# EasyEDA Pro project X轴限位转接板--(0909).eprj

# Schematic 原理图
Board Name: XZ转接板; Create Date: 2024-04-22; Page Name: 主控MCU; Project Name: Z轴转接板-0814; Schematic Name: 原理图; Update Date: 2025-05-19; Company: 嘉立创EDA; Page Size: A3; Version: V1.0
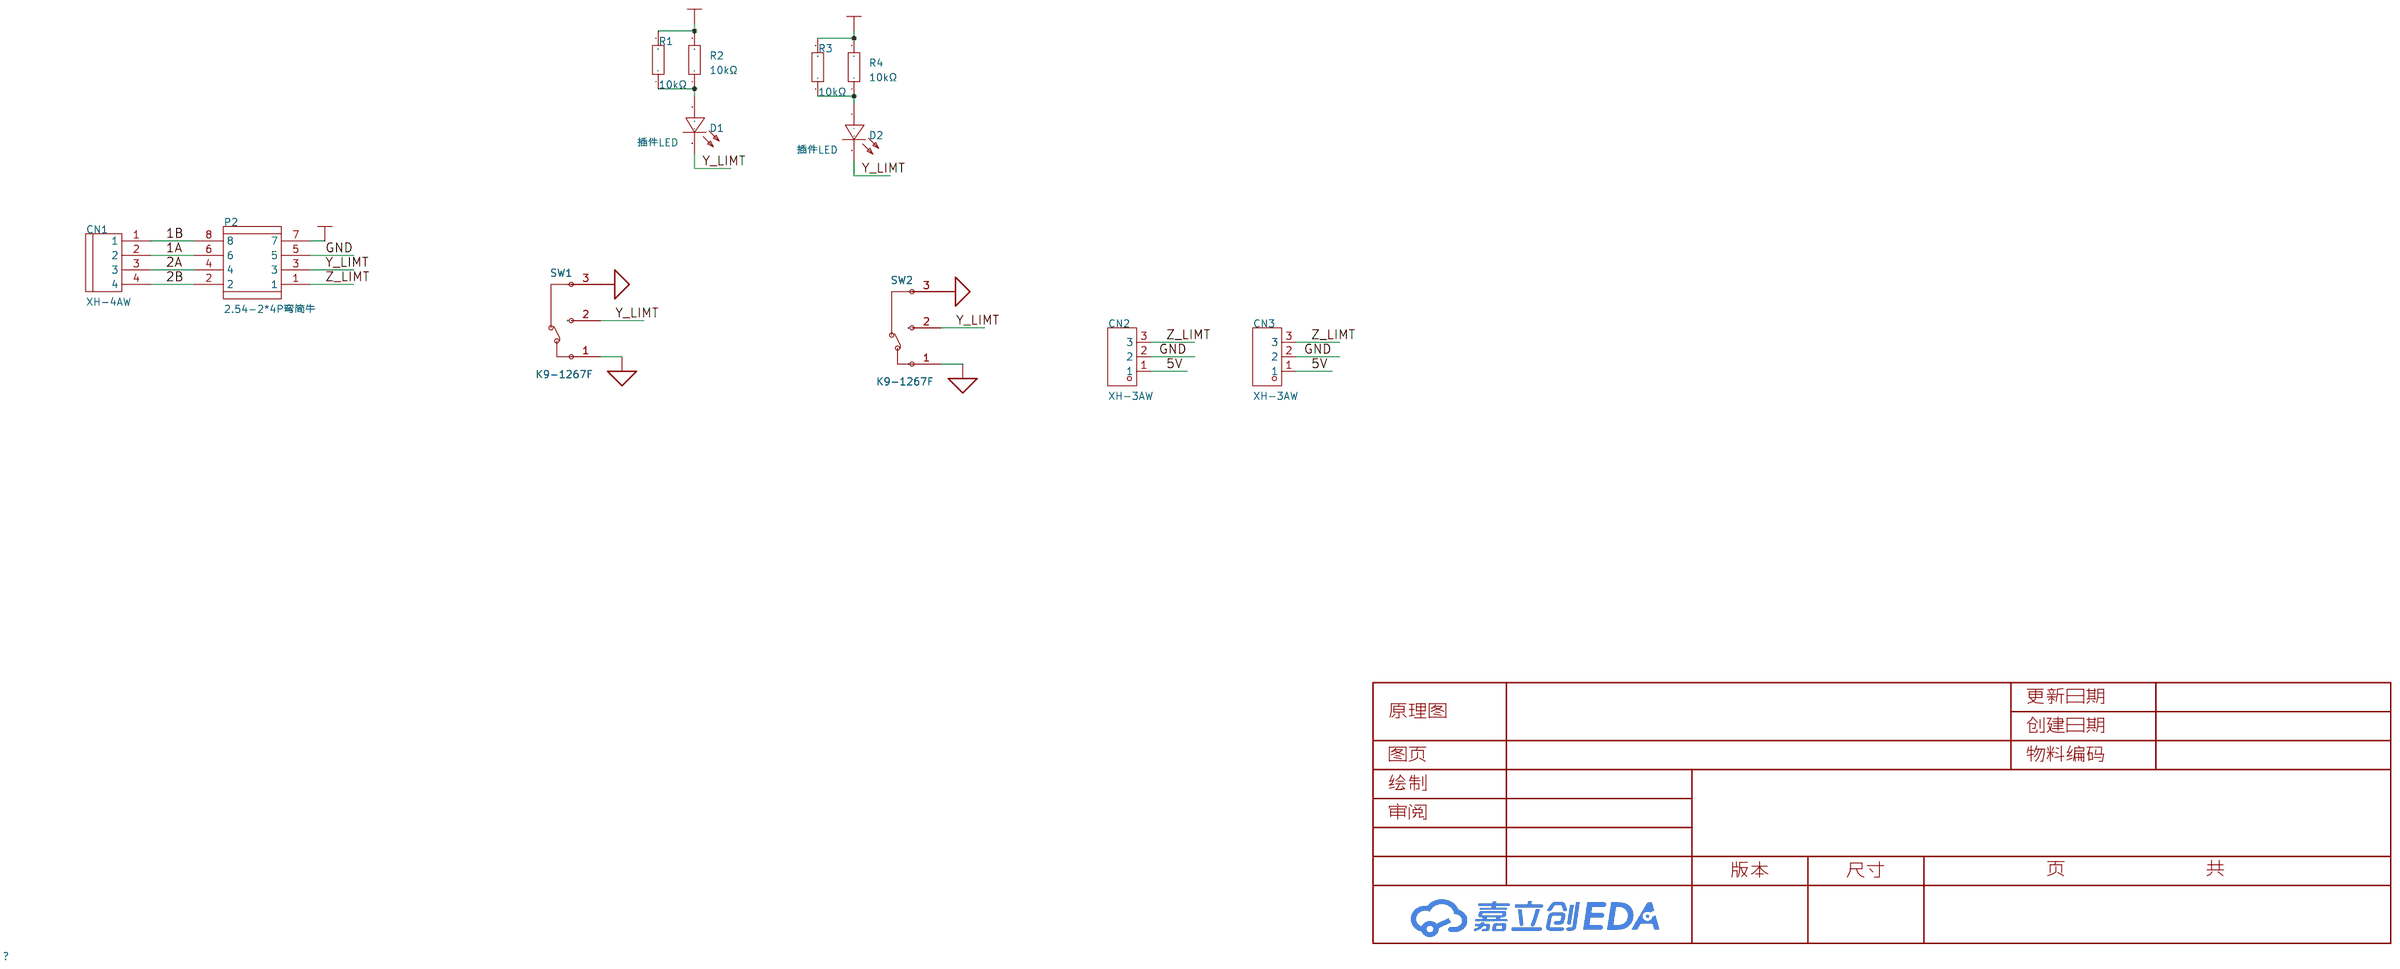
[diagram p0: schematic sheet]

## Parts
CN1  XH-4AW  [CONN-TH_XH2.54-4AW]
CN2  XH-3AW  [CONN-TH_3P-P2.50_XH-3A]
CN3  XH-3AW  [CONN-TH_3P-P2.50_XH-3A]
D1  插件LED  [LED-TH_BD3.8-P2.54-FD]
D2  插件LED  [LED-TH_BD3.8-P2.54-FD]
P2  2.54-2*4P弯简牛  [IDC-TH_8P-P2.54-H-R2-C4-S2.54]
R1  10kΩ  [R1206]
R2  10kΩ  [R1206]
R3  10kΩ  [R1206]
R4  10kΩ  [R1206]
SW1  K9-1267F  [SW-TH_K9-1267F]
SW2  K9-1267F  [SW-TH_K9-1267F]

## Library data of the parts
CN1 = XH-4AW: LCSC Part Name: XH-4AW，4P，脚距2.5mm，卧插; Supplier Part: C21273; Manufacturer: BOOMELE(博穆精密); Supplier Footprint: 插件,P=2.5mm; JLCPCB Part Class: Extended Part; Datasheet: https://atta.szlcsc.com/upload/public/pdf/source/20170919/C21273_1505787293543977054.pdf; Supplier: LCSC; Reference Series: XH; Pitch: 2.5mm; Pins Structure: 1x4P; Number of Rows: 1; Number of PINs Per Row: 4; Contact Material: 磷青铜
CN2 CN3 = XH-3AW: LCSC Part Name: XH-3AW，3P，脚距2.5mm，卧插 卧插; Supplier Part: C18428; Manufacturer: BOOMELE(博穆精密); Supplier Footprint: 插件,P=2.5mm; JLCPCB Part Class: Extended Part; Datasheet: https://atta.szlcsc.com/upload/public/pdf/source/20151222/1457707638029.pdf; Supplier: LCSC; Reference Series: XH; Pitch: 2.5mm; Pins Structure: 1x3P; Number of Rows: 1; Number of PINs Per Row: 3
D1 D2 = 204-10SURC/S530-A3-L: LCSC Part Name: 红灯; Supplier Part: C264302; Manufacturer: EVERLIGHT(台湾亿光); Supplier Footprint: 插件,D=3mm; JLCPCB Part Class: Extended Part; Datasheet: https://atta.szlcsc.com/upload/public/pdf/source/20181204/C264302_3C164FC09690301AE5D79DE2C4875559.pdf; Supplier: LCSC; Emitted Color: 红灯
P2 = 2.54-2*4P弯简牛: LCSC Part Name: 2.54mm 2x4P 排数:2 每排P数:4; Supplier Part: C9139; Manufacturer: BOOMELE(博穆精密); Supplier Footprint: 弯插,P=2.54mm; JLCPCB Part Class: 扩展库; Datasheet: https://atta.szlcsc.com/upload/public/pdf/source/20180802/C9139_ED436C264503447E9FC33A60E4514237.pdf; Supplier: LCSC; Connector Type: 简牛座; Pitch: 2.54mm; Structure: 2x4P; Holder Type: 弯插; Row Spacing: 2.54mm; Number of Rows: 2; Pin Number in each Row: 4
R1-R4 = RC1206FR-073KL: LCSC Part Name: 3kΩ ±1%; Supplier Part: C132648; Manufacturer: YAGEO(国巨); Supplier Footprint: 1206; JLCPCB Part Class: Extended Part; Datasheet: https://atta.szlcsc.com/upload/public/pdf/source/20170925/C132648_1506321710667990513.pdf; Supplier: LCSC; Operating Temperature Range: -55℃~+155℃; Power(Watts): 250mW; Tolerance: ±1%; Type: 厚膜电阻; Temperature Coefficient: ±100ppm/℃; Overload Voltage (Max): 200V
SW1 SW2 = K9-1267F: LCSC Part Name: 弧形压柄300万次寿命小微动 12.7mm*5.7mm; Supplier Part: C107263; Manufacturer: 韩国韩荣; Supplier Footprint: 插件; JLCPCB Part Class: Extended Part; Datasheet: https://atta.szlcsc.com/upload/public/pdf/source/20201214/C107263_D9656DE761E5BF43078859A56D7E33A8.pdf; Supplier: LCSC; Type: 微动开关; Contact Current (DC): 100mA; Voltage Rating (DC): 30V; Contact Current (AC): 1A; Voltage Rating (AC): 125V; Circuit: 单刀双掷; Mechanical Life: 3000000; Operating Temperature: -25℃~+85℃; Switch Length: 12.7mm; Switch Width: 5.7mm; Switch Height: 12.8mm

## Nets
5V: CN2.1 CN3.1 P2.7 R1.2 R2.2 R3.2 R4.2
GND: CN2.2 CN3.2 P2.5 SW1.1(C) SW1.3(NC) SW2.1(C) SW2.3(NC)
1A: CN1.2 P2.6
1B: CN1.1 P2.8
2A: CN1.3 P2.4
2B: CN1.4 P2.2
Y_LIMT: D1.2(K) D2.2(K) P2.3 SW1.2(NO) SW2.2(NO)
Z_LIMT: CN2.3 CN3.3 P2.1
$1N79082: D1.1(A) R1.1 R2.1
$1N79207: D2.1(A) R3.1 R4.1

# Board PCB
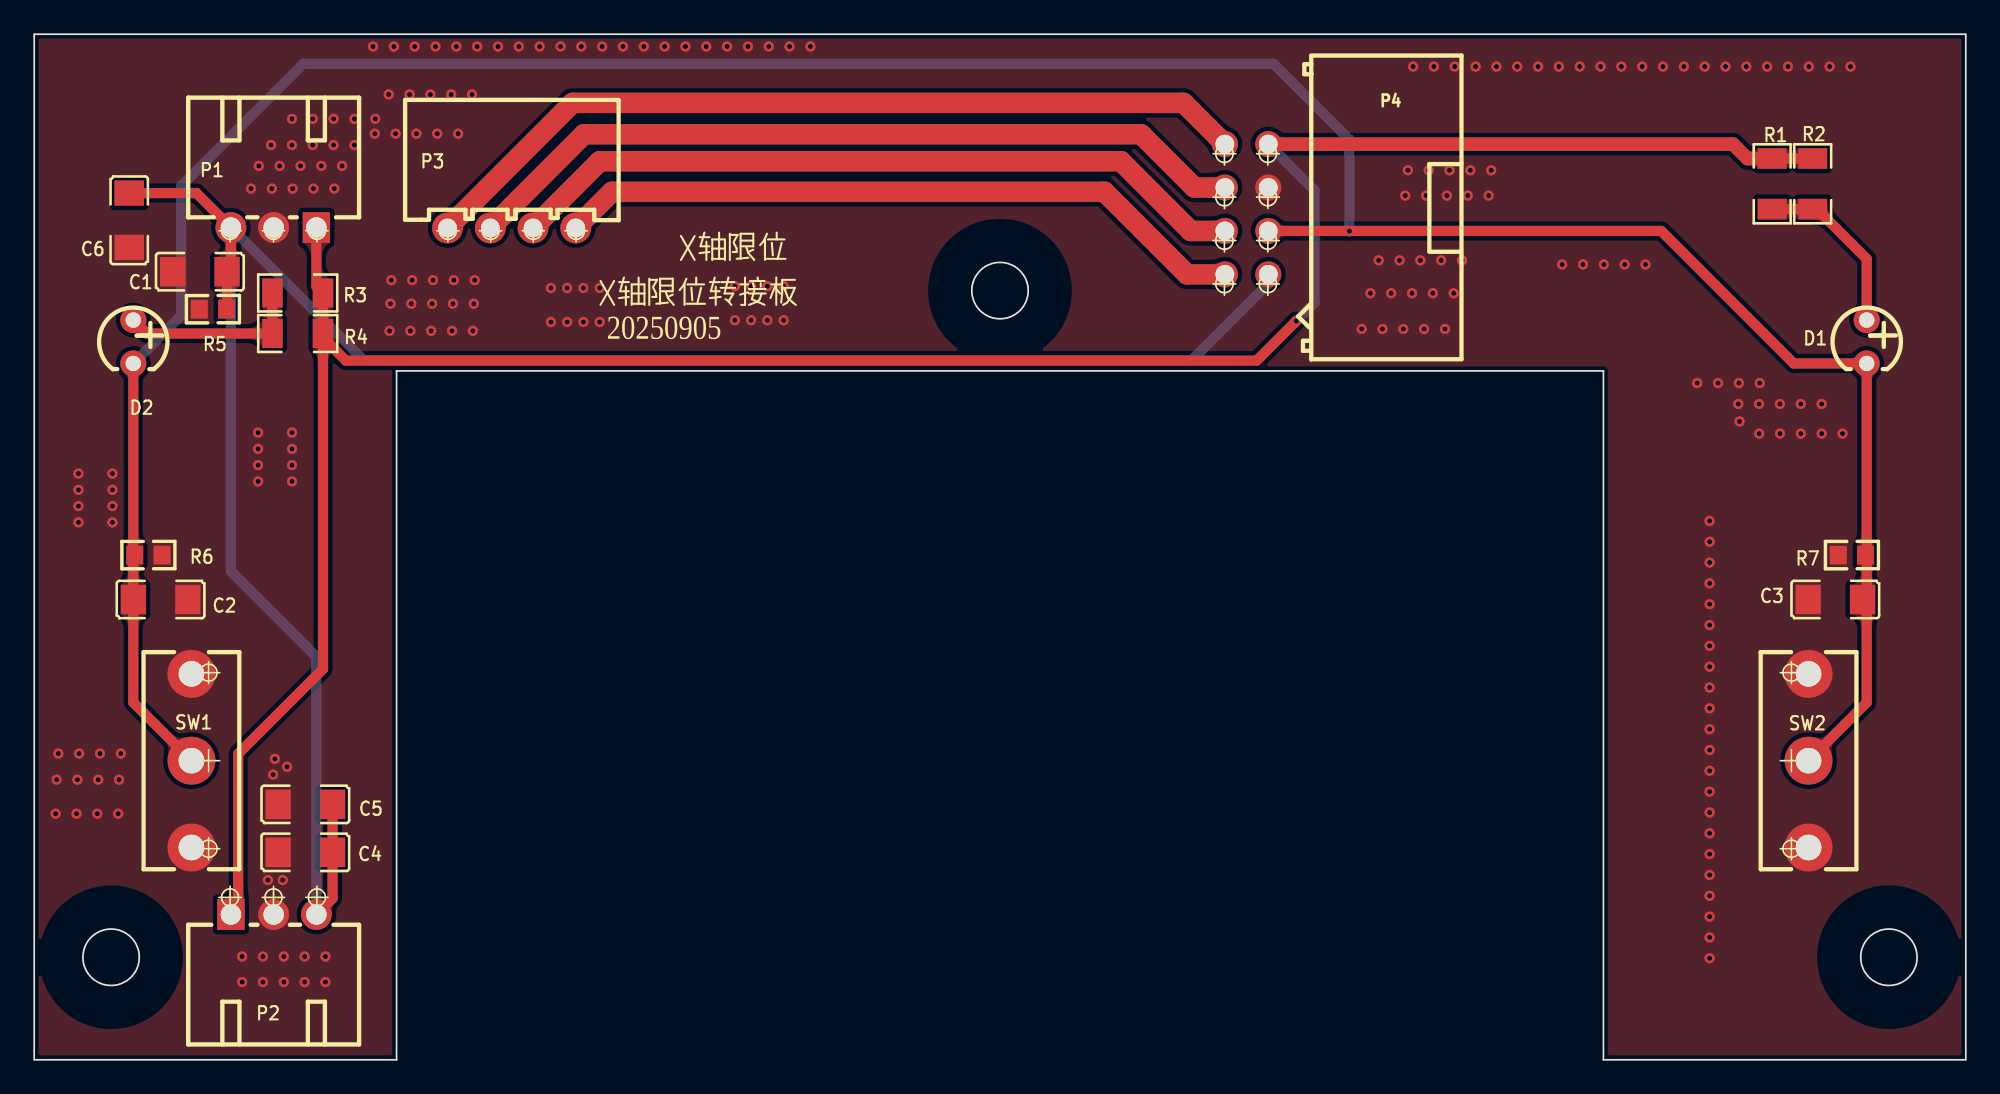
[diagram p1: board, top side]
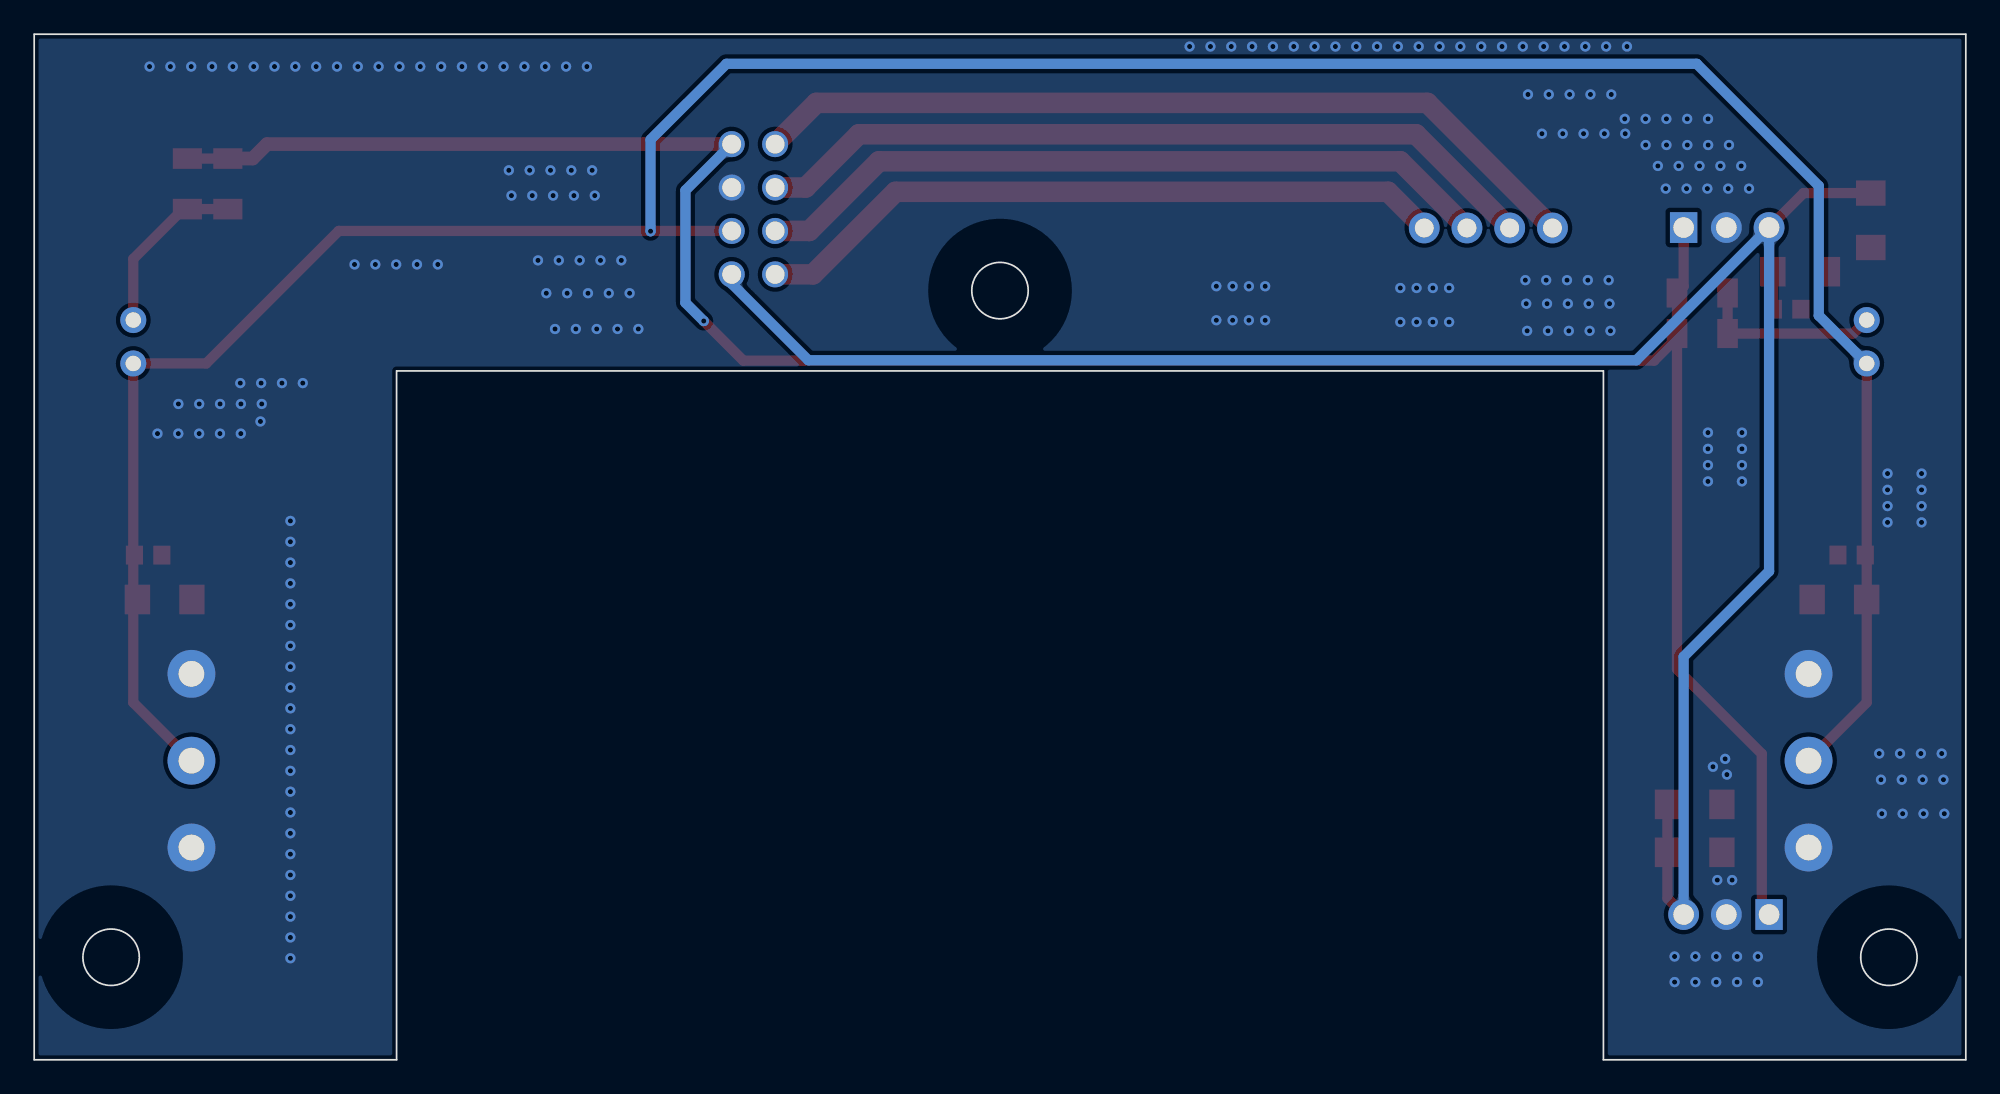
[diagram p2: board, bottom side, seen from below]

Outline 113 x 60 mm; copper layers: Top Layer, Bottom Layer. Coordinates in mm from the lower left corner of the outline.
Outline path: circle c4.5,6 r1.65 ; circle c56.5,45 r1.65 ; circle c108.5,6 r1.65 ; 0,60 0,0 21.2,0 21.2,40.3 91.8,40.3 91.8,0 113,0 113,60 0,60
Stack: Top Layer 0.035mm / Dielectric1 1.51mm FR4 er 4.5 / Bottom Layer 0.035mm

## Design rules (mm)
template: 用户自定义配置
spacing Default (default): track to track 0.152, other pairs 0 to 0.152
track width Default (default): min 0.254, default 0.254, max 25.4
differential pair differentialPair (default): width min 0.127, default 0.254, max 2.54; gap min 0.152, default 0.152
via Default (default): diameter min 0.25, default 0.61, max 100.025; hole min 0.2, default 0.305, max 59.995

## Placement (name value [footprint] x y rotation side)
C1  4.7uF  [C1206]  9.69 46.1 0 top
C2  4.7uF  [C1206]  7.39 26.93 180 top
C3  4.7uF  [C1206]  105.37 26.93 0 top
C4  4.7uF  [C1206]  15.86 12.14 0 top
C5  4.7uF  [C1206]  15.86 14.94 0 top
C6  4.7uF  [C1206]  5.56 49.11 90 top
D1  插件LED  [LED-TH_BD3.8-P2.54-FD]  107.2 42.01 270 top
D2  插件LED  [LED-TH_BD3.8-P2.54-FD]  5.8 42.01 270 top
P1  XH-3AW  [CONN-TH_3P-P2.50_XH-3A]  14.01 48.69 180 top
P2  2.54-2*4P弯简牛  [CONN-TH_3P-P2.50_XH-3A]  14.01 8.5 0 top
P3  XH-4AW  [CONN-TH_XH2.54-4AW]  27.93 48.66 0 top
P4  2.54-2*4P弯简牛  [IDC-TH_8P-P2.54-H-R2-C4-S2.54]  70.92 49.76 90 top
R1  10kΩ  [R1206]  101.67 51.25 90 top
R2  10kΩ  [R1206]  104.04 51.25 90 top
R3  10kΩ  [R1206]  15.42 44.86 0 top
R4  10kΩ  [R1206]  15.42 42.49 0 top
R5  10K  [0603R]  10.46 43.91 0 top
R6  10K  [0603R]  6.68 29.53 180 top
R7  10K  [0603R]  106.34 29.52 0 top
SW1  K9-1267F  [SW-TH_K9-1267F]  9.2 17.5 90 top
SW2  K9-1267F  [SW-TH_K9-1267F]  103.8 17.5 90 top

## Footprints (pads in the part's own frame, mm; a bottom-side part is the same pattern mirrored in y, then rotated)
0603R
  rect 1x1.1 smd: 1(-0.8,0) 2(0.8,0)
C1206
  rect 1.485x1.728 smd: 1(-1.593,0) 2(1.593,0)
CONN-TH_3P-P2.50_XH-3A
  rect 1.6x1.801 hole 1.199: 1(-2.499,0)
  round 1.801 hole 1.199: 2(0,0) 3(2.499,0)
CONN-TH_XH2.54-4AW
  round 1.8 hole 1.1: 1(-3.751,0) 2(-1.248,0) 3(1.251,0) 4(3.751,0)
IDC-TH_8P-P2.54-H-R2-C4-S2.54
  round 1.524 hole 1.1: 1(-3.81,-1.27) 2(-3.81,1.27) 3(-1.27,-1.27) 4(-1.27,1.27) 5(1.27,-1.27) 6(1.27,1.27) 7(3.81,-1.27) 8(3.81,1.27)
LED-TH_BD3.8-P2.54-FD
  round 1.524 hole 0.9: 1(-1.27,0) 2(1.27,0)
R1206
  rect 1.208x1.701 smd: 1(-1.479,0) 2(1.479,0)
SW-TH_K9-1267F
  round 2.799 hole 1.501x1: 1(-5.08,0) 2(0,0) 3(5.08,0)

## Nets
5V: P1.1 P2.1 P4.7 R1.2 R2.2 R3.2 R4.2
GND: C1.1 C2.1 C3.1 C4.1 C5.1 C6.1 P1.2 P2.2 P4.5 R5.1 R6.1 R7.1 SW1.1 SW1.3 SW2.1 SW2.3
1A: P3.2 P4.6
1B: P3.1 P4.8
2A: P3.3 P4.4
2B: P3.4 P4.2
Y_LIMT: C2.2 C3.2 D1.2 D2.2 P4.3 R6.2 R7.2 SW1.2 SW2.2
Z_LIMT: C1.2 C4.2 C5.2 C6.2 P1.3 P2.3 P4.1 R5.2
$1N79082: D1.1 R1.1 R2.1
$1N79207: D2.1 R3.1 R4.1

## Via types
v1: diameter 0.6, hole 0.3, Top Layer to Bottom Layer, 217 vias

## Routing (per net, layer and track width the routed paths; a pad name or vN(x,y) marks a point on that pad's centre or on a via; arc(x,y) is an arc through that point)
5V: length 145.1
  Top Layer w0.6: P1.1 16.51,45.25 R3.2 R4.2 16.9,42.24 ; 16.9,42.24 16.9,22.86 11.93,17.9 11.93,8.92 P2.1 ; 16.9,42.24 18.23,40.9 71.51,40.9 v1(73.83,43.22) ; R2.2 R1.2
  Top Layer w0.8: P4.7 99.38,53.57 100.22,52.73 R1.2
  Bottom Layer w0.6: v1(73.83,43.22) 74.9,44.29 74.9,50.86 P4.7
GND:
  vias: v1(1.31,16.39) v1(1.26,14.4) v1(1.41,17.92) v1(2.48,14.4) v1(2.59,34.3) v1(2.59,33.34) v1(2.59,32.39) v1(2.59,31.44) v1(2.53,16.39) v1(2.63,17.92) v1(3.69,14.4) v1(3.75,16.39) v1(3.85,17.92) v1(4.58,34.3) v1(4.58,33.34) v1(4.58,32.39) v1(4.58,31.44) v1(4.91,14.4) v1(4.96,16.39) v1(5.07,17.92) v1(12.16,6.04) v1(12.16,4.55) v1(12.68,50.97) v1(13.1,36.69) v1(13.1,35.74) v1(13.1,34.79) v1(13.1,33.84) v1(13.14,52.29) v1(13.38,6.04) v1(13.38,4.55) v1(13.67,10.52) v1(13.86,53.52) v1(13.9,50.97) v1(13.98,16.69) v1(14.08,17.6) v1(14.36,52.29) v1(14.54,10.52) v1(14.6,6.04) v1(14.6,4.55) v1(14.79,17.15) v1(15.08,55.05) v1(15.07,53.52) v1(15.12,50.97) v1(15.09,36.69) v1(15.09,35.74) v1(15.09,34.79) v1(15.09,33.84) v1(15.58,52.29) v1(15.82,6.04) v1(15.82,4.55) v1(16.3,55.05) v1(16.29,53.52) v1(16.34,50.97) v1(16.8,52.29) v1(17.04,6.04) v1(17.04,4.55) v1(17.52,55.05) v1(17.51,53.52) v1(17.56,50.97) v1(18.02,52.29) v1(18.73,55.05) v1(18.73,53.52) v1(19.82,59.28) v1(19.92,54.18) v1(19.95,55.05) v1(20.74,56.47) v1(20.79,42.65) v1(20.89,45.61) v1(20.84,44.23) v1(21.04,59.28) v1(21.14,54.18) v1(21.96,56.47) v1(22.01,42.65) v1(22.11,45.61) v1(22.06,44.23) v1(22.26,59.28) v1(22.36,54.18) v1(23.18,56.47) v1(23.22,42.65) v1(23.28,44.23) v1(23.33,45.61) v1(23.48,59.28) v1(23.58,54.18) v1(24.4,56.47) v1(24.5,44.23) v1(24.44,42.65) v1(24.55,45.61) v1(24.7,59.28) v1(24.8,54.18) v1(25.61,56.47) v1(25.72,44.23) v1(25.66,42.65) v1(25.77,45.61) v1(25.91,59.28) v1(27.13,59.28) v1(28.35,59.28) v1(29.57,59.28) v1(30.23,45.15) v1(30.23,43.16) v1(30.79,59.28) v1(31.18,45.15) v1(31.18,43.16) v1(32.01,59.28) v1(32.13,45.15) v1(32.13,43.16) v1(33.08,45.15) v1(33.08,43.16) v1(33.22,59.28) v1(34.44,59.28) v1(35.66,59.28) v1(36.88,59.28) v1(38.1,59.28) v1(39.32,59.28) v1(40.53,59.28) v1(40.99,45.25) v1(40.99,43.26) v1(41.75,59.28) v1(41.94,45.25) v1(41.94,43.26) v1(42.89,45.25) v1(42.89,43.26) v1(42.97,59.28) v1(43.84,45.25) v1(43.84,43.26) v1(44.19,59.28) v1(45.41,59.28) v1(77.66,42.75) v1(78.17,44.85) v1(78.65,46.77) v1(78.88,42.75) v1(79.39,44.85) v1(79.87,46.77) v1(80.09,42.75) v1(80.21,50.56) v1(80.36,52.04) v1(80.6,44.85) v1(80.67,58.11) v1(81.09,46.77) v1(81.31,42.75) v1(81.43,50.56) v1(81.58,52.04) v1(81.82,44.85) v1(81.89,58.11) v1(82.31,46.77) v1(82.53,42.75) v1(82.64,50.56) v1(82.8,52.04) v1(83.1,58.11) v1(83.04,44.85) v1(83.53,46.77) v1(83.86,50.56) v1(84.02,52.04) v1(84.32,58.11) v1(85.08,50.56) v1(85.23,52.04) v1(85.54,58.11) v1(86.76,58.11) v1(87.98,58.11) v1(89.2,58.11) v1(89.39,46.53) v1(90.41,58.11) v1(90.61,46.53) v1(91.63,58.11) v1(91.82,46.53) v1(92.85,58.11) v1(93.04,46.53) v1(94.07,58.11) v1(94.26,46.53) v1(95.29,58.11) v1(96.51,58.11) v1(97.29,39.59) v1(97.72,58.11) v1(98.01,31.53) v1(98.01,30.31) v1(98.01,29.09) v1(98.01,27.87) v1(98.01,26.65) v1(98.01,25.43) v1(98.01,24.22) v1(98.01,23) v1(98.01,21.78) v1(98.01,20.56) v1(98.01,19.34) v1(98.01,18.12) v1(98.01,16.91) v1(98.01,15.69) v1(98.01,14.47) v1(98.01,13.25) v1(98.01,12.03) v1(98.01,10.81) v1(98.01,9.6) v1(98.01,8.38) v1(98.01,7.16) v1(98.01,5.94) v1(98.51,39.59) v1(98.94,58.11) v1(99.72,39.59) v1(99.69,38.37) v1(99.76,37.35) v1(100.16,58.11) v1(100.91,38.37) v1(100.91,36.63) v1(100.94,39.59) v1(101.38,58.11) v1(102.13,38.37) v1(102.13,36.63) v1(102.6,58.11) v1(103.35,38.37) v1(103.35,36.63) v1(103.82,58.11) v1(104.56,38.37) v1(104.57,36.63) v1(105.03,58.11) v1(105.79,36.63) v1(106.25,58.11)
1A: length 46.5
  Top Layer w1.2: P4.6 67.87,51.03 64.75,54.15 32.17,54.15 P3.2
1B: length 49.5
  Top Layer w1.2: P4.8 67.24,55.98 31.5,55.98 P3.1
2A: length 43.8
  Top Layer w1.2: P3.3 33.08,52.56 63.58,52.56 67.66,48.49 P4.4
2B: length 40.9
  Top Layer w1.2: P3.4 33.8,50.78 62.61,50.78 67.44,45.95 P4.2
Y_LIMT: length 177.6
  Top Layer w0.6: D2.2 5.8,20.9 SW1.2 ; P4.3 95.19,48.49 102.94,40.74 D1.2 107.2,20.9 SW2.2
  Bottom Layer w0.6: v1(76.94,48.47) 76.94,53.83 72.51,58.27 15.74,58.27 8.6,51.13 8.6,43.54 D2.2
Z_LIMT: length 127.1
  Top Layer w0.6: C5.2 C4.2 17.45,9.45 P2.3 ; C6.2 9.49,50.71 P1.3 11.51,46.33 C1.2 11.28,43.94 11.25,43.91
  Bottom Layer w0.6: P2.3 16.51,23.58 11.51,28.58 P1.3 19.27,40.93 67.71,40.93 72.2,45.41 P4.1
$1N79082: length 10.3
  Top Layer w0.6: R1.1 R2.1 104.29,49.77 107.2,46.85 D1.1
$1N79207: length 10.8
  Top Layer w0.6: D2.1 6.59,42.49 R4.1 R3.1

## Copper pours and planes (outline as drawn; the poured copper is in the pictures)
GND on Top Layer: -12.26,69.49 124.73,69.49 124.73,-15.23 -12.26,-15.23
GND on Bottom Layer: -4.05,63.83 115.7,63.83 115.7,-3.14 -4.05,-3.14

Small or netless copper shapes (teardrops, artwork), in the pictures only: 48 on Top Layer, 6 on Bottom Layer

## Text on the board
Top Silkscreen Layer: X轴限位转接板 | 20250905 | X轴限位
